# EAGLE design M_E_ext_proto (EAGLE 9.6.2)
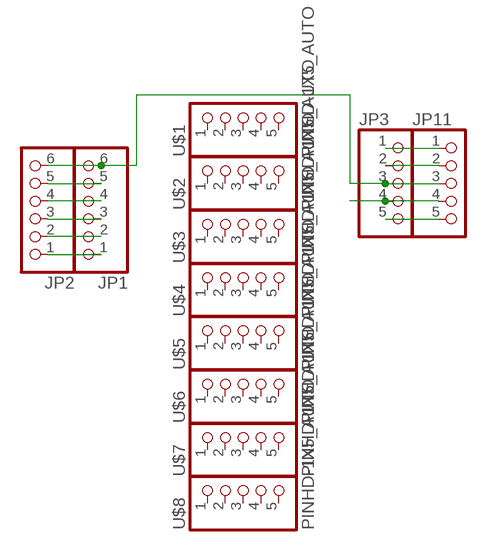
[diagram p0: schematic, sheet 1]

## Parts
JP1  PINHD-1X6  [1X06]
JP2  PINHD-1X6  [1X06]
JP3  PINHD-1X5  [1X05]
JP11  PINHD-1X5  [1X05]
U$1  PINHD-1X5_AUTO  [1X5_AUTO]
U$2  PINHD-1X5_AUTO  [1X5_AUTO]
U$3  PINHD-1X5_AUTO  [1X5_AUTO]
U$4  PINHD-1X5_AUTO  [1X5_AUTO]
U$5  PINHD-1X5_AUTO  [1X5_AUTO]
U$6  PINHD-1X5_AUTO  [1X5_AUTO]
U$7  PINHD-1X5_AUTO  [1X5_AUTO]
U$8  PINHD-1X5_AUTO  [1X5_AUTO]

## Nets
GND: JP1.6 JP2.6 JP3.3 JP11.3
N$1: JP1.5 JP2.5
N$2: JP1.4 JP2.4
N$3: JP1.3 JP2.3
N$4: JP1.2 JP2.2
N$5: JP1.1 JP2.1
N$6: JP3.5 JP11.5
N$7: JP3.2 JP11.2
N$8: JP3.1 JP11.1
VDD: JP3.4 JP11.4
Unconnected: U$1.1 U$1.2 U$1.3 U$1.4 U$1.5 U$2.1 U$2.2 U$2.3 U$2.4 U$2.5 U$3.1 U$3.2 U$3.3 U$3.4 U$3.5 U$4.1 U$4.2 U$4.3 U$4.4 U$4.5 U$5.1 U$5.2 U$5.3 U$5.4 U$5.5 U$6.1 U$6.2 U$6.3 U$6.4 U$6.5 U$7.1 U$7.2 U$7.3 U$7.4 U$7.5 U$8.1 U$8.2 U$8.3 U$8.4 U$8.5

## Library data of the parts
JP1 JP2 = pinhead2:PINHD-1X6: PIN HEADER
JP3 JP11 = pinhead2:PINHD-1X5: PIN HEADER
U$1-U$8 = pinhead2:PINHD-1X5_AUTO

## Board
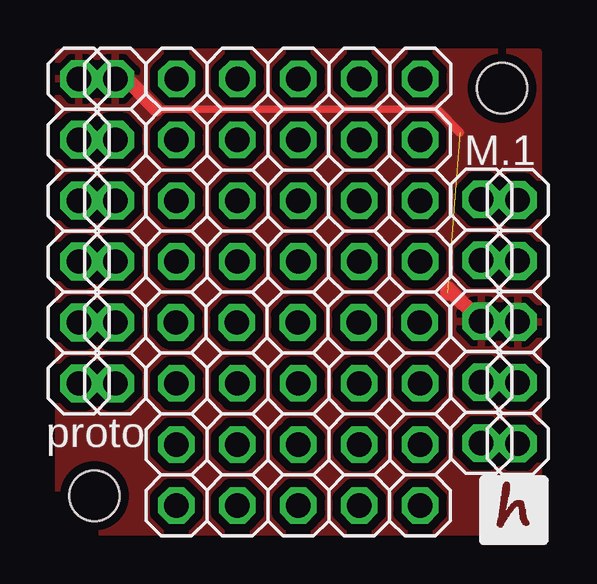
[diagram p1: board, top side]
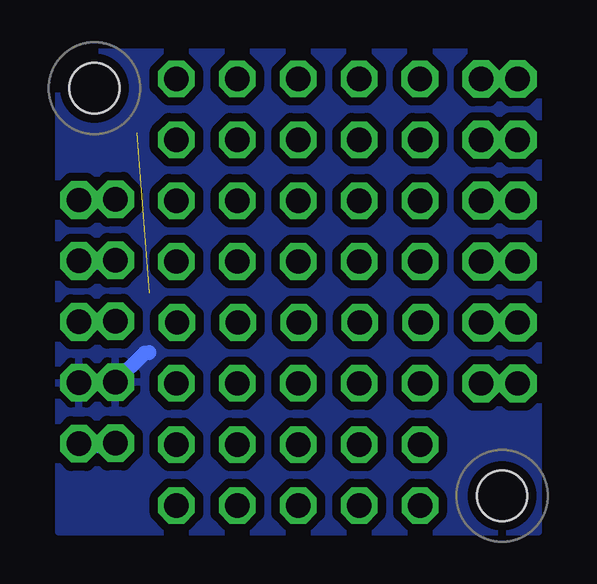
[diagram p2: board, bottom side, seen from below]

No outline drawn. Coordinates in mm, seen from the top.
Copper layers (1*16): Top 0.035mm / dielectric 1.5mm / Bottom 0.035mm
Design rules "default *": minimum track width 14mil, minimum drill 0.35mm, track to track 14mil, track to pad 13mil, pad to pad 14mil, via to via 14mil, smd to smd 14mil, copper to edge 15mil, drill to drill 15mil, minimum pad ring 10mil, minimum via ring 8mil, stop-mask expansion 4mil, vias tented up to drill 0mil, thermal gap 10mil
Holes 2.1 mm at 19,19 2,2

### Footprints (pad centres in the part's own frame; a part is rotated, then mirrored left to right if it is on the bottom)
1X06 = drill 1.016 pad 1.575 octagon: 1 -6.35,0; 2 -3.81,0; 3 -1.27,0; 4 1.27,0; 5 3.81,0; 6 6.35,0
1X05 = drill 1.016 pad 1.575 octagon: 1 -5.08,0; 2 -2.54,0; 3 0,0; 4 2.54,0; 5 5.08,0
1X5_AUTO = drill 1.016 octagon: 1 -5.08,0; 2 -2.54,0; 3 0,0; 4 2.54,0; 5 5.08,0

### Placement (x,y rotation side)
JP1  2.87,13.04 90 top
JP2  1.35,13.04 90 top
JP3  18.13,9.28 270 top
JP11  19.65,9.26 270 top
U$1  10.51,19.39 0 top
U$2  10.5,16.85 0 top
U$3  10.5,14.31 0 top
U$4  10.5,11.77 0 top
U$5  10.47,9.23 0 top
U$6  10.5,6.69 0 top
U$7  10.5,4.14 0 top
U$8  10.5,1.6 0 top

### Tracks (layer width: path | path; a pad name or v marks a point on that pad's centre or on a via)
GND  (1 unrouted)
  Top 0.305: 4.57,18.13 16.27,18.13
  Top 0.356: JP11.3 19.64,9.24 18.01,9.2 | 16.27,18.13 17.24,17.16
  Top 0.61: JP3.3 16.71,10.66 16.71,10.46 | JP1.6 3.4,19.3 4.57,18.13
  Bottom 0.61: JP11.3 19.65,9.15 19.59,9.2 18.18,9.23 JP3.3 | JP1.6 1.67,19.39 1.36,19.38 JP2.6
  pour Top (isolate 0.305): 0.5,20.5 20.5,20.5 20.5,0.5 0.5,0.5
N$1
  Bottom 0.61: JP1.5 2.8,16.92 1.36,16.86 JP2.5
N$2
  Bottom 0.61: JP1.4 1.39,14.25 JP2.4
N$3
  Bottom 0.61: JP1.3 1.67,11.77 1.36,11.76 JP2.3
N$4
  Bottom 0.61: JP1.2 1.67,9.23 1.36,9.22 JP2.2
N$5
  Bottom 0.61: JP1.1 1.65,6.69 JP2.1
N$6
  Bottom 0.61: JP11.5 19.6,4.08 18.21,4.06 JP3.5
N$7
  Bottom 0.61: JP3.2 18.17,11.71 19.64,11.72 JP11.2
N$8
  Bottom 0.61: JP11.1 18.09,14.29 18.02,14.35 17.98,14.31 17.98,14.27 JP3.1
VDD
  Bottom 0.61: 19.55,6.68 19.57,6.68 JP11.4 19.62,6.74 JP3.4 16.92,7.95 16.74,7.95 16.71,7.98
  pour Bottom (isolate 0.305): 0.5,20.5 20.5,20.5 20.5,0.5 0.5,0.5

### Text on the board
tPlace: M.1 | proto